# EAGLE design oloduino (EAGLE 5.10)
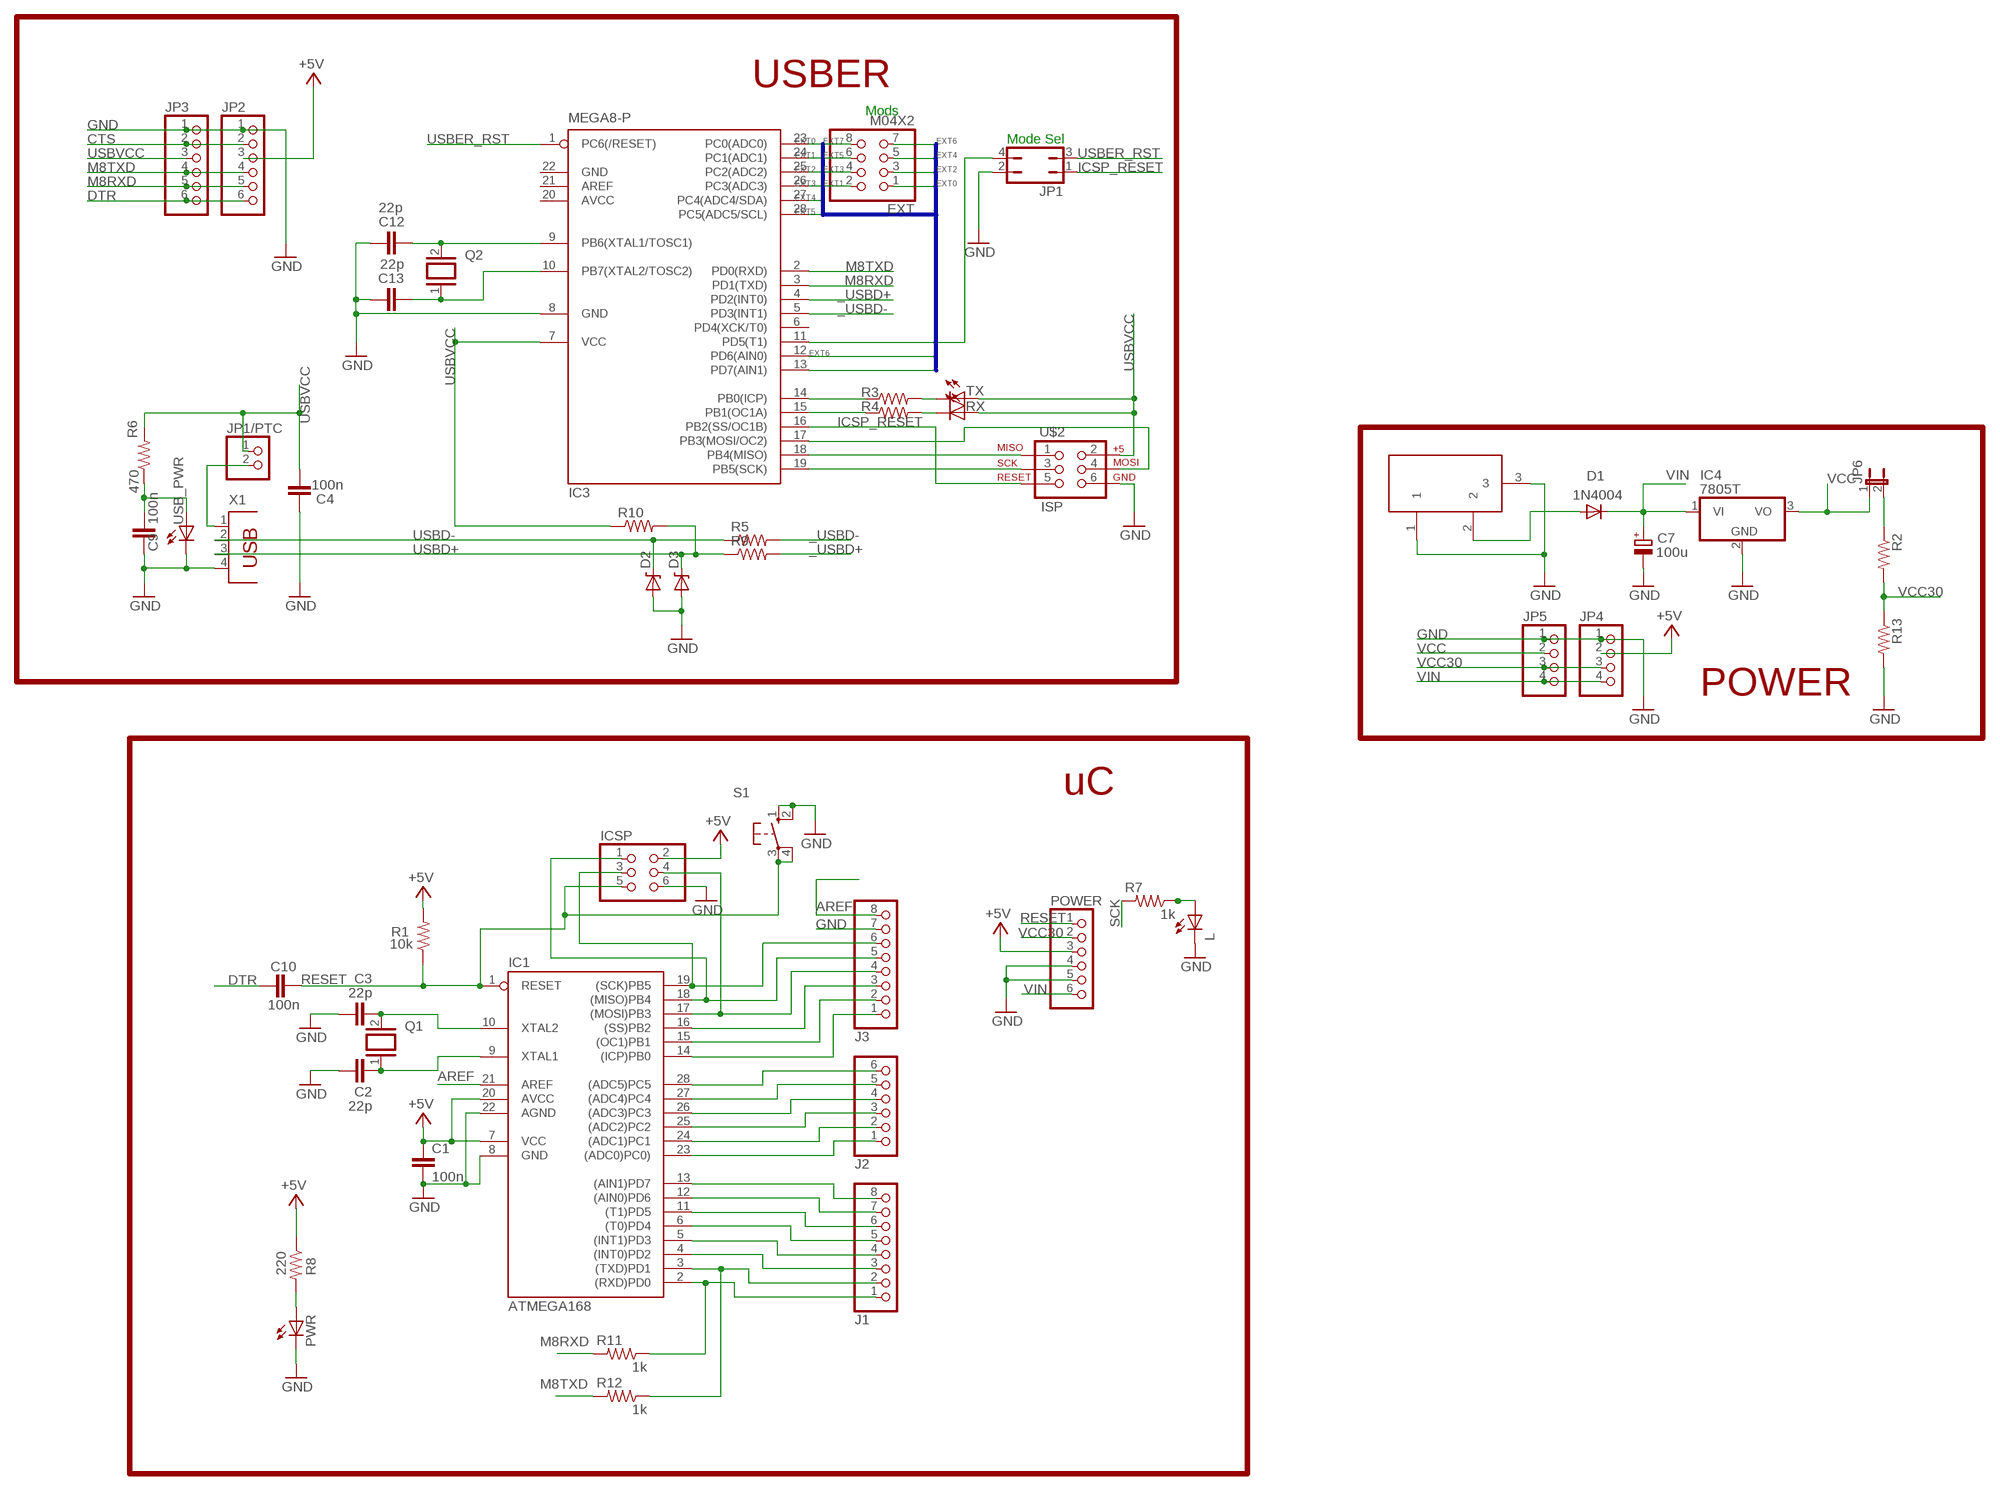
[diagram p0: schematic, sheet 1]

## Parts
C1  100n  C-EU050-025X075  [C050-025X075]
C2  22p  C-EU050-025X075  [C050-025X075]
C3  22p  C-EU050-025X075  [C050-025X075]
C4  100n  C-EU050-025X075  [C050-025X075]
C7  100u  CPOL-EUE3.5-8  [E3,5-8]
C9  100n  C-EU050-025X075  [C050-025X075]
C10  100n  C-EU050-025X075  [C050-025X075]
C12  22p  C-EU050-024X044  [C050-024X044]
C13  22p  C-EU050-024X044  [C050-024X044]
D1  1N4004  [DO41-10]
D2  DIODE-ZENERSMB  [SMB-DIODE]
D3  DIODE-ZENERSMB  [SMB-DIODE]
DC1  DC21MMX  [DC-21MM]
EXT  M04X2  PINHD-2X4  [2X04]
IC1  ATMEGA168  AT90S4433P  [DIL28-3]
IC3  MEGA8-P  [DIL28-3]
IC4  7805T  [TO220H]
ICSP  PINHD-2X3  [2X03]
J1  PINHD-1X8  [1X08]
J2  PINHD-1X6  [1X06]
J3  PINHD-1X8  [1X08]
JP1  JP2Q  [JP2Q]
JP1/PTC  PINHD-1X2  [1X02]
JP2  PINHD-1X6  [1X06]
JP3  PINHD-1X6  [1X06]
JP4  PINHD-1X4  [1X04]
JP5  PINHD-1X4  [1X04]
JP6  JUMPER-2SMD-NC  [SJ_2S]
L  LED3MM  [LED3MM]
POWER  PINHD-1X6  [1X06]
PWR  LED3MM  [LED3MM]
Q1  XTAL/S  [QS]
Q2  XTAL/S  [QS]
R1  10k  R-US_0207/10  [0207/10]
R2  R-US_0204/2V  [0204V]
R3  R-US_0207/10  [0207/10]
R4  R-US_0207/10  [0207/10]
R5  R-US_0207/10  [0207/10]
R6  470  R-US_0207/10  [0207/10]
R7  1k  R-US_0207/10  [0207/10]
R8  220  R-US_0207/10  [0207/10]
R9  R-US_0207/10  [0207/10]
R10  R-US_0207/10  [0207/10]
R11  1k  R-US_0207/10  [0207/10]
R12  1k  R-US_0207/10  [0207/10]
R13  R-US_0204/2V  [0204V]
RX  LED3MM  [LED3MM]
S1  10-XX  [B3F-10XX]
TX  LED3MM  [LED3MM]
U$2  ISP  AVR_SPI_PRG_6NS  [2X3-NS]
USB_PWR  LED3MM  [LED3MM]
X1  PN61729  [PN61729]

## Nets
+5V [power]: C1.1 IC1.7(VCC) IC1.20(AVCC) ICSP.2 JP2.3 JP4.2 POWER.3 R1.2 R8.1
_USBD+: IC3.4(PD2(INT0)) R9.2
_USBD-: IC3.5(PD3(INT1)) R5.2
AREF: IC1.21(AREF) J3.8
CTS: JP2.2 JP3.2
DTR: C10.1 JP2.6 JP3.6
EXT0: EXT.1 IC3.23(PC0(ADC0))
EXT1: EXT.2 IC3.24(PC1(ADC1))
EXT2: EXT.3 IC3.25(PC2(ADC2))
EXT3: EXT.4 IC3.26(PC3(ADC3))
EXT4: EXT.5 IC3.27(PC4(ADC4/SDA))
EXT5: EXT.6 IC3.28(PC5(ADC5/SCL))
EXT6: EXT.7 IC3.12(PD6(AIN0))
EXT7: EXT.8 IC3.13(PD7(AIN1))
GND [power]: C1.2 C2.1 C3.1 C4.2 C7.- C9.2 C12.2 C13.1 D2.A D3.A DC1.1 DC1.3 IC1.8(GND) IC1.22(AGND) IC3.8(GND) IC4.2(GND) ICSP.6 J3.7 JP1.2 JP2.1 JP3.1 JP4.1 JP5.1 L.K(C) POWER.4 POWER.5 PWR.K(C) R13.2 S1.1(S) S1.2(S1) U$2.6 USB_PWR.K(C) X1.4
ICSP_RESET: IC3.16(PB2(SS/OC1B)) JP1.1 U$2.5
M8RXD: IC3.3(PD1(TXD)) JP2.5 JP3.5 R11.2
M8TXD: IC3.2(PD0(RXD)) JP2.4 JP3.4 R12.2
N$1: IC1.18((MISO)PB4) ICSP.1 J3.5
N$2: L.A R7.1
N$3: PWR.A R8.2
N$4: IC1.17((MOSI)PB3) ICSP.4 J3.4
N$5: IC1.14((ICP)PB0) J3.1
N$6: C2.2 IC1.9(XTAL1) Q1.1
N$7: C3.2 IC1.10(XTAL2) Q1.2
N$8 [power]: D1.A DC1.2
N$9: C12.1 IC3.9(PB6(XTAL1/TOSC1)) Q2.2
N$10: IC1.4((INT0)PD2) J1.3
N$11: IC1.5((INT1)PD3) J1.4
N$12: IC1.6((T0)PD4) J1.5
N$13: IC1.11((T1)PD5) J1.6
N$14: IC1.12((AIN0)PD6) J1.7
N$15: IC1.13((AIN1)PD7) J1.8
N$16: IC1.23((ADC0)PC0)) J2.1
N$17: IC1.24((ADC1)PC1) J2.2
N$18: IC1.25((ADC2)PC2) J2.3
N$19: IC1.26((ADC3)PC3) J2.4
N$20: IC1.27((ADC4)PC4) J2.5
N$21: IC1.28((ADC5)PC5) J2.6
N$22: IC1.15((OC1)PB1) J3.2
N$23: IC1.16((SS)PB2) J3.3
N$25: R3.2 TX.K(C)
N$26: IC3.14(PB0(ICP)) R3.1
N$27: R4.2 RX.K(C)
N$28: IC3.15(PB1(OC1A)) R4.1
N$29: JP6.2 R2.1
N$30: C9.1 R6.1 USB_PWR.A
N$34 [power]: JP1/PTC.2 X1.1
N$35: IC3.11(PD5(T1)) JP1.4
N$41: C13.2 IC3.10(PB7(XTAL2/TOSC2)) Q2.1
N$43: IC3.17(PB3(MOSI/OC2)) U$2.4
N$46: IC3.18(PB4(MISO)) U$2.1
N$47: IC3.19(PB5(SCK)) U$2.3
RESET: C10.2 IC1.1(RESET) ICSP.5 POWER.1 R1.1 S1.3(P) S1.4(P1)
RXD: IC1.2((RXD)PD0) J1.1 R11.1
SCK: IC1.19((SCK)PB5) ICSP.3 J3.6 R7.2
TXD: IC1.3((TXD)PD1) J1.2 R12.1
USBD+: D3.C R9.1 R10.2 X1.3
USBD-: D2.C R5.1 X1.2
USBER_RST: IC3.1(PC6(/RESET)) JP1.3
USBVCC [power]: C4.1 IC3.7(VCC) JP1/PTC.1 JP3.3 R6.2 R10.1 RX.A TX.A U$2.2
VCC [power]: IC4.3(VO) JP5.2 JP6.1
VCC30: JP4.3 JP5.3 POWER.2 R2.2 R13.1
VIN [power]: C7.+ D1.C IC4.1(VI) JP4.4 JP5.4 POWER.6
Unconnected: IC3.6(PD4(XCK/T0)) IC3.21(AREF)

## Buses
EXT[0..8]

## Notes on the sheet
- USBER
- Mods
- Mode Sel
- POWER
- uC

## Power pins joined to a net without a drawn wire
AVCC: IC3.20(AVCC)
GND: IC3.22(GND)

## Library data of the parts
C1-C4 C9 C10 C12 C13 = rcl:C-EU: CAPACITOR, European symbol
C7 = rcl:CPOL-EU: POLARIZED CAPACITOR, European symbol
D1 = diode:1N4004: DIODE general purpose rectifier, 1 A
D2 D3 = SparkFun:DIODE-ZENER
DC1 = powersupply:DC21MM
EXT = pinhead:PINHD-2X4: PIN HEADER
IC1 = atmel:AT90S4433: MICROCONTROLLER 4 Kbytes FLASH 128 bytes SRAM 256 bytes EEPROM UART 6-channel 10 bit ADC
IC3 = atmel:MEGA8-P: MICROCONTROLLER 8 Kbytes FLASH, 1 kbytes SRAM, 512 bytes EEPROM, USART, 4-channel 10 bit ADC, 2-channel 8 bit ADC Pin compatible with Atmega48, ATMega88, ATMega168 Source: avr.lbr
IC4 = linear:78*: Positive VOLTAGE REGULATOR Source: http://cache.national.com/ds/LM/LM78L05.pdf http://www.fairchildsemi.com/ds/LM/LM7805.pdf
ICSP = pinhead:PINHD-2X3: PIN HEADER
J1 J3 = pinhead:PINHD-1X8: PIN HEADER
J2 JP2 JP3 POWER = pinhead:PINHD-1X6: PIN HEADER
JP1 = jumper:JP2Q: JUMPER
JP1/PTC = pinhead:PINHD-1X2: PIN HEADER
JP4 JP5 = pinhead:PINHD-1X4: PIN HEADER
JP6 = SparkFun:JUMPER-2: Jumper Basic 0.1" spaced jumper. Use with breakaway headers.
L PWR RX TX USB_PWR = led:LED: LED OSRAM: - CHIPLED LG R971, LG N971, LY N971, LG Q971, LY Q971, LO R971, LY R971 LH N974, LH R974 LS Q976, LO Q976, LY Q976 LO Q996 - Hyper CHIPLED LW Q18S LB Q993, LB Q99A, LB R99A - SideLED LS A670, LO A670, LY A670, LG A670, LP A670 LB A673, LV A673, LT A673, LW A673 LH A674 LY A675 LS A676, LA A676, LO A676, LY A676, LW A676 LS A679, LY A679, LG A679 - Hyper Micro SIDELED® LS Y876, LA Y876, LO Y876, LY Y876 LT Y87S - SmartLED LW L88C, LW L88S LB L89C, LB L89S, LG L890 LS L89K, LO L89K, LY L89K LS L896, LA L896, LO L896, LY L896 - TOPLED LS T670, LO T670, LY T670, LG T670, LP T670 LSG T670, LSP T670, LSY T670, LOP T670, LYG T670 LG T671, LOG T671, LSG T671 LB T673, LV T673, LT T673, LW T673 LH T674 LS T676, LA T676, LO T676, LY T676, LB T676, LH T676, LSB T676, LW T676 LB T67C, LV T67C, LT T67C, LS T67K, LO T67K, LY T67K, LW E67C LS E67B, LA E67B, LO E67B, LY E67B, LB E67C, LV E67C, LT E67C LW T67C LS T679, LY T679, LG T679 LS T770, LO T770, LY T770, LG T770, LP T770 LB T773, LV T773, LT T773, LW T773 LH T774 LS E675, LA E675, LY E675, LS T675 LS T776, LA T776, LO T776, LY T776, LB T776 LHGB T686 LT T68C, LB T68C - Hyper Mini TOPLED® LB M676 - Mini TOPLED Santana® LG M470 LS M47K, LO M47K, LY M47K Source: http://www.osram.convergy.de/
Q1 Q2 = special:XTAL/S: CRYSTAL
R1-R13 = resistor:R-US_: RESISTOR, American symbol
S1 = switch-omron:10-XX: OMRON SWITCH
U$2 = SparkFun:AVR_SPI_PRG_6: AVR ISP 6 Pin This is the reduced ISP connector for AVR programming. Common on Arduino. This footprint will take up less PCB space and can be used with a 10-pin to 6-pin adapter such as SKU: BOB-08508
X1 = con-berg:PN61729: BERG USB connector

## Net classes
1 power: width 0.406 mm

## Board
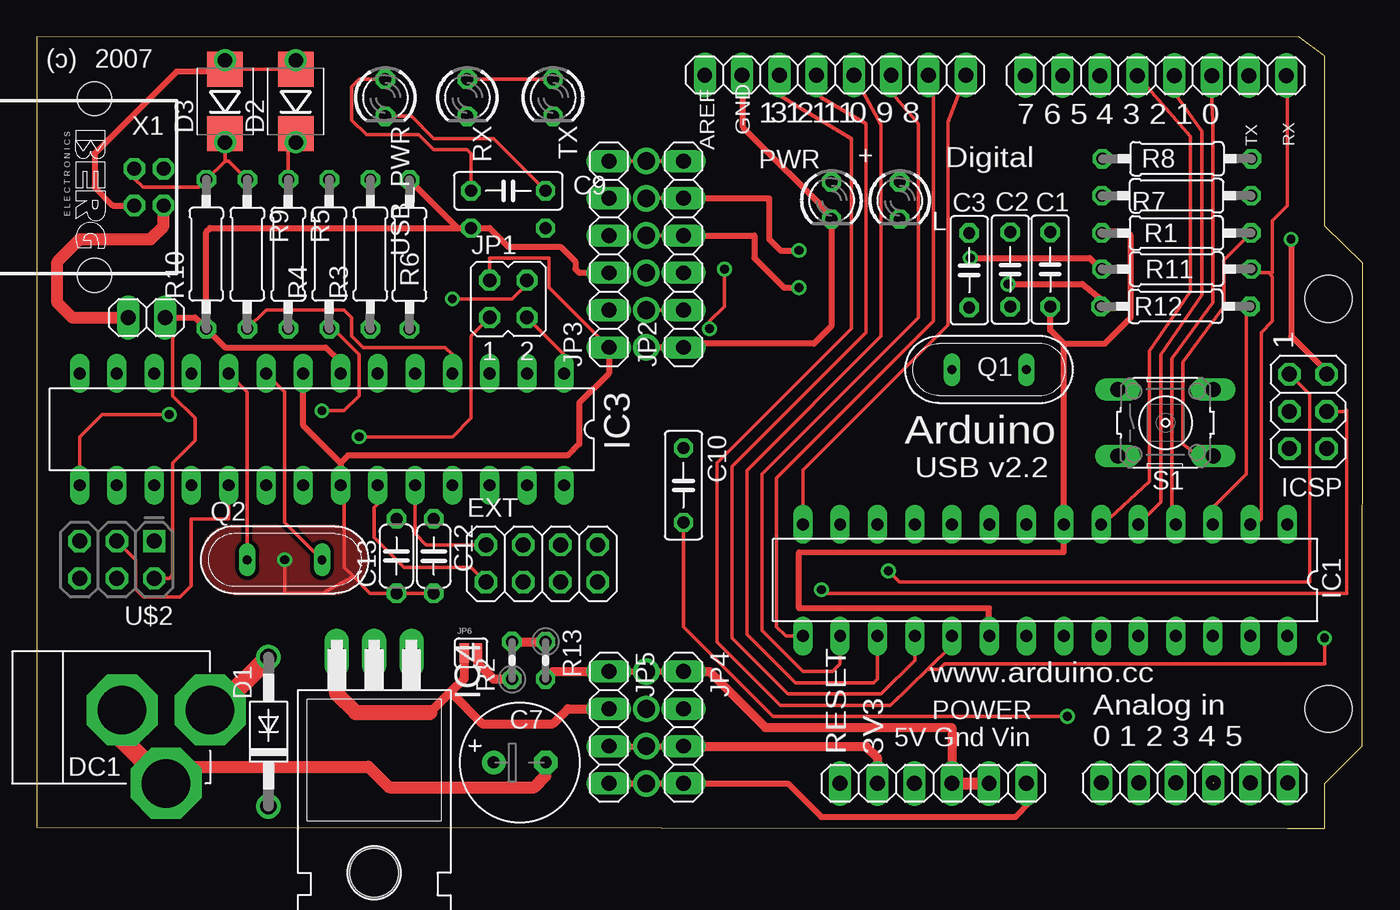
[diagram p1: board, top side]
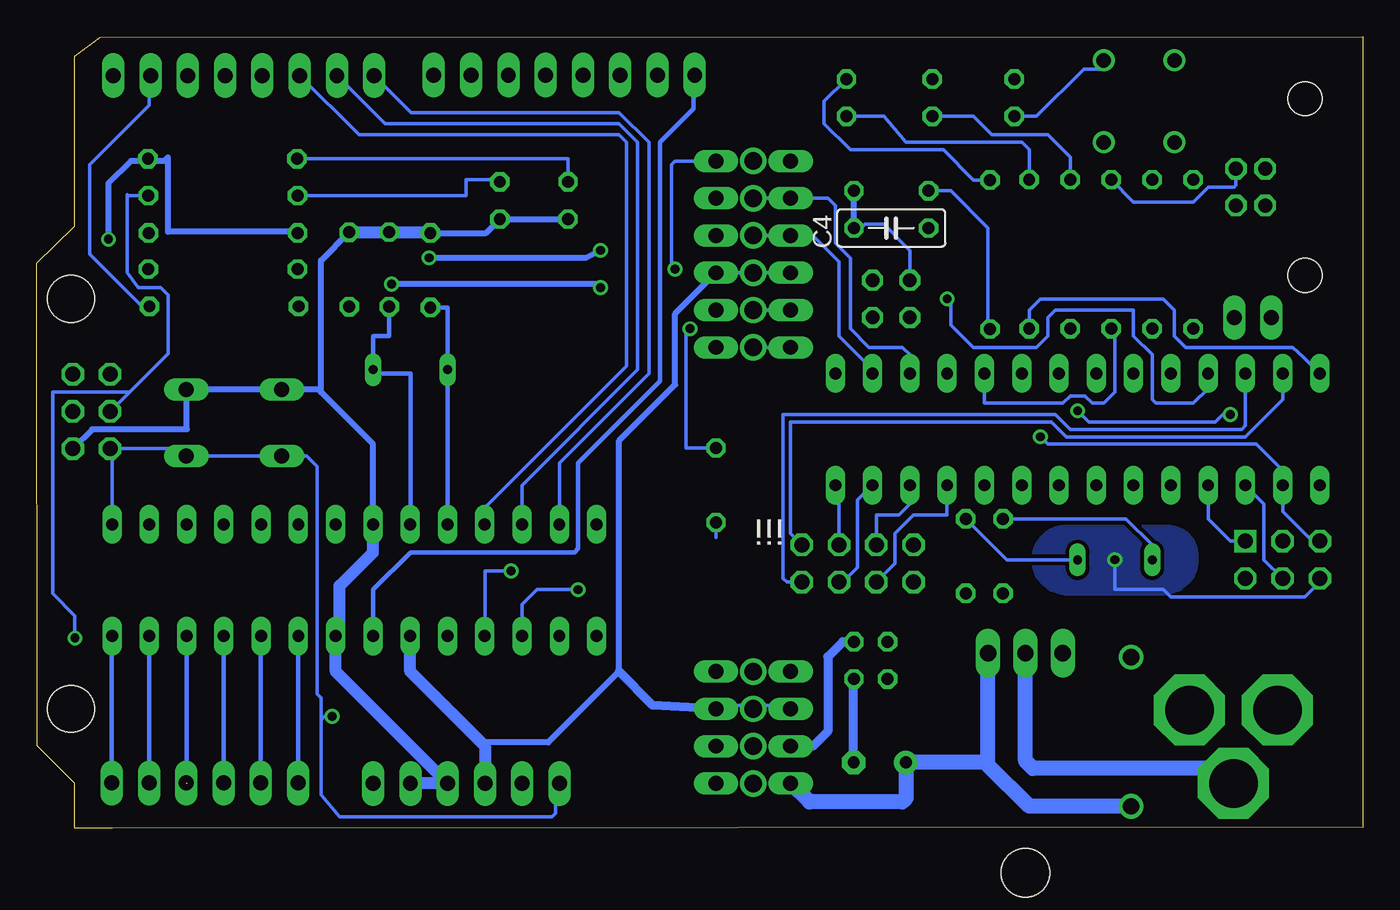
[diagram p2: board, bottom side, seen from below]

Size 90.36 x 53.95 mm. Coordinates in mm from the lower left corner, seen from the top.
Outline: 0,53.95 0,0.05 85.22,0.01 87.78,0 87.77,0.05 87.76,3.06 90.34,5.61 90.36,38.51 87.76,41.05 87.76,52.6 86.03,53.91 0,53.95
Copper layers (1*16): Top 0.035mm / dielectric 1.5mm / Bottom 0.035mm
Design rules "default *": minimum track width 10mil, minimum drill 10mil, track to track 10mil, track to pad 10mil, pad to pad 10mil, via to via 10mil, smd to smd 8mil, copper to edge 20mil, drill to drill 8mil, minimum pad ring 10mil, minimum via ring 8mil, stop-mask expansion 4mil, vias tented up to drill 0mil, thermal gap 10mil
Holes 3.2 mm at 88.01,36.08 88.01,8.14
tKeepout: 3 lines
bKeepout: 2 lines

### Footprints (pad centres in the part's own frame; a part is rotated, then mirrored left to right if it is on the bottom)
C050-025X075 = drill 0.813 octagon: 1 -2.54,0; 2 2.54,0
E3,5-8 = drill 0.813 pad 1.6 round: + -1.778,0 | drill 0.813 pad 1.6 octagon: - 1.778,0
C050-024X044 = drill 0.813 octagon: 1 -2.54,0; 2 2.54,0
DO41-10 = drill 1.118 round: A 5.08,0; C -5.08,0
SMB-DIODE = smd 2.4 x 2.4: A 2.2,0; C -2.2,0
DC-21MM = drill 3.302 pad 4.826 octagon: 1 -5.08,-3.353; 2 -0.076,-6.35; 3 -0.076,-0.356
2X04 = drill 1.016 octagon: 1 -3.81,-1.27; 2 -3.81,1.27; 3 -1.27,-1.27; 4 -1.27,1.27; 5 1.27,-1.27; 6 1.27,1.27; 7 3.81,-1.27; 8 3.81,1.27
DIL28-3 = drill 0.813 long: 1 -16.51,-3.81; 2 -13.97,-3.81; 3 -11.43,-3.81; 4 -8.89,-3.81; 5 -6.35,-3.81; 6 -3.81,-3.81; 7 -1.27,-3.81; 8 1.27,-3.81; 9 3.81,-3.81; 10 6.35,-3.81; 11 8.89,-3.81; 12 11.43,-3.81; 13 13.97,-3.81; 14 16.51,-3.81; 15 16.51,3.81; 16 13.97,3.81; 17 11.43,3.81; 18 8.89,3.81; 19 6.35,3.81; 20 3.81,3.81; 21 1.27,3.81; 22 -1.27,3.81; 23 -3.81,3.81; 24 -6.35,3.81; 25 -8.89,3.81; 26 -11.43,3.81; 27 -13.97,3.81; 28 -16.51,3.81
TO220H = drill 1.118 long: 1 -2.54,-10.16; 2 0,-10.16; 3 2.54,-10.16 | hole 3.302: 0,4.826
2X03 = drill 1.016 octagon: 1 -2.54,-1.27; 2 -2.54,1.27; 3 0,-1.27; 4 0,1.27; 5 2.54,-1.27; 6 2.54,1.27
1X08 = drill 1.016 long: 1 -8.89,0; 2 -6.35,0; 3 -3.81,0; 4 -1.27,0; 5 1.27,0; 6 3.81,0; 7 6.35,0; 8 8.89,0
1X06 = drill 1.016 long: 1 -6.35,0; 2 -3.81,0; 3 -1.27,0; 4 1.27,0; 5 3.81,0; 6 6.35,0
JP2Q = drill 0.914 octagon: 1 -1.27,-1.27; 2 -1.27,1.27; 3 1.27,-1.27; 4 1.27,1.27
1X02 = drill 1.016 long: 1 -1.27,0; 2 1.27,0
1X04 = drill 1.016 long: 1 -3.81,0; 2 -1.27,0; 3 1.27,0; 4 3.81,0
SJ_2S = smd 0.635 x 1.27: 1 -0.45,0; 2 0.45,0
LED3MM = drill 0.813 octagon: A -1.27,0; K 1.27,0
QS = drill 0.61 long: 1 -2.54,0; 2 2.54,0
0207/10 = drill 0.813 octagon: 1 -5.08,0; 2 5.08,0
0204V = drill 0.813 octagon: 1 -1.27,0; 2 1.27,0
B3F-10XX = drill 1.016 long: 1 -3.251,2.261; 2 3.251,2.261; 3 -3.251,-2.261; 4 3.251,-2.261
2X3-NS = drill 1.016 square: 1 -2.54,-1.27 | drill 1.016 octagon: 2 -2.54,1.27; 3 0,-1.27; 4 0,1.27; 5 2.54,-1.27; 6 2.54,1.27
PN61729 = drill 0.95 octagon: 1 1.25,4.71; 2 -1.25,4.71; 3 -1.25,2.71; 4 1.25,2.71 | hole 2.3: -6.02,0; 6.02,0

### Placement (x,y rotation side)
C1  69.06,38.08 90 top
C2  66.34,38.09 270 top
C3  63.54,38.04 270 top
C4  32.13,40.9 180 bottom
C7  32.91,4.48 0 top
C9  32.13,43.44 0 top
C10  44.07,23.38 270 top
C12  27.05,18.55 270 top
C13  24.51,18.55 90 top
D1  15.8,6.58 90 top
D2  17.66,49.54 90 top
D3  12.83,49.54 90 top
DC1  5.46,8.14 90 top
EXT  34.42,18.04 0 top
IC1  68.72,16.91 180 top
IC3  19.43,27.19 180 top
IC4  22.99,1.79 180 top
ICSP  86.63,28.41 270 top
J1  76.26,51.3 180 top
J2  78.9,3.09 0 top
J3  54.41,51.34 180 top
JP1  32.13,36.08 0 top
JP1/PTC  7.5,34.81 180 top
JP2  44.07,39.13 90 top
JP3  38.99,39.13 90 top
JP4  44.07,6.87 270 top
JP5  38.99,6.87 270 top
JP6  29.59,11.95 0 top
L  58.8,42.78 270 top
POWER  61.09,3.06 0 top
PWR  54.16,42.78 270 top
Q1  64.9,31.26 180 top
Q2  16.89,18.3 0 top
R1  77.66,40.57 180 top
R2  32.39,11.44 90 top
R3  22.74,39.13 90 top
R4  19.94,39.13 90 top
R5  17.15,39.13 270 top
R6  25.4,39.1 90 top
R7  77.68,43.11 0 top
R8  77.7,45.63 180 top
R9  14.35,39.13 270 top
R10  11.56,39.13 90 top
R11  77.68,38.11 180 top
R12  77.6,35.57 180 top
R13  34.67,11.44 270 top
RX  29.34,49.79 270 top
S1  76.91,27.63 0 top
TX  35.18,49.79 270 top
U$2  5.46,18.3 180 top
USB_PWR  23.75,49.79 270 top
X1  3.94,43.7 270 top

### Tracks (layer width: path | path; a pad name or v marks a point on that pad's centre or on a via)
+5V  (via drill 0.6)
  Top 0.406: IC1.20 64.9,15 51.95,15 51.95,18.81 69.99,18.82 IC1.7 69.98,33.03 | 69.98,33.03 69.06,33.95 C1.1 | R1.2 72.58,40.46 72.77,40.65 74.3,40.65 74.55,40.4 74.55,34.81 72.77,33.03 69.98,33.03 | v85.47,40.14 85.47,33.54 87.9,31.11 ICSP.2
  Bottom 0.254: 38.99,8.39 43.82,8.39 JP4.2
  Bottom 0.406: 82.93,45.48 R8.1 | 82.93,45.48 83.95,45.48 85.47,43.95 v85.47,40.14 | R1.2 72.66,40.65 81.41,40.65 81.41,45.73 81.66,45.48 82.93,45.48 | JP2.3 46.87,35.06 46.87,30.24 50.68,26.43 50.68,10.68 55.5,5.85 60.07,5.85
  Bottom 0.61: JP4.2 48.39,8.39 50.68,10.68
  Bottom 0.813: POWER.3 59.82,5.6 60.07,5.85 64.91,10.69 IC1.20
_USBD+
  Top 0.254: IC3.4 28.32,32.27 27.82,32.78 22.23,32.78 21.47,33.54 21.47,34.81 20.96,35.32 15.62,35.32 R9.2
_USBD-
  Bottom 0.254: IC3.5 25.78,28.97 20.45,28.97 19.94,29.47 18.93,29.47 18.42,28.97 17.66,28.97 16.89,29.73 16.89,33.79 R5.2
AREF
  Bottom 0.305: IC1.21 67.44,16.27 64.9,18.81 53.72,18.81 53.47,19.06 53.47,24.9 47.88,30.49 47.88,46.75 45.6,49.03 45.6,51.27 J3.8
CTS  (via drill 1.2)
  Top 0.254: v41.53,35.32 JP2.2
  Bottom 0.254: JP3.2 v41.53,35.32
DTR  (via drill 0.6, 1.2)
  Top 0.254: v45.85,34.05 45.85,34.55 46.87,35.57 v46.87,38.11 | JP2.6 v41.53,45.48 JP3.6
  Bottom 0.254: v45.85,34.05 46.1,33.79 46.1,25.92 C10.1 | v46.87,38.11 47.12,38.62 47.12,45.22 46.87,45.48 JP2.6
EXT0
  Top 0.254: IC3.23 23.24,22.11 22.99,21.85 22.99,19.82 25.02,17.79 29.59,17.79 EXT.1
EXT1
  Top 0.254: EXT.2 26.55,19.31 25.78,20.08 IC3.24
EXT2
  Bottom 0.254: EXT.3 31.88,18.04 31.88,20.08 30.61,21.35 28.32,21.35 IC3.25
EXT3
  Bottom 0.254: EXT.4 33.15,21.35 31.63,21.35 30.86,22.11 IC3.26
EXT4
  Bottom 0.254: EXT.5 35.44,16.77 34.42,17.79 34.42,22.36 IC3.27
EXT5
  Bottom 0.254: EXT.6 35.69,23.12 IC3.28
EXT6
  Bottom 0.254: IC3.12 8,27.44 8.26,27.19 19.94,27.19 20.96,28.2 39.5,28.2 39.5,17.03 39.25,16.77 EXT.7
EXT7
  Bottom 0.254: IC3.13 5.46,29.22 8,26.68 20.2,26.68 21.21,27.7 38.99,27.7 38.99,20.08 EXT.8
GND  (via drill 0.6, 1, 1.2)
  Top 0.254: C12.2 C13.1 22.74,16.01 21.59,17.16 | 21.59,17.16 20.96,17.79 20.96,23.12 IC3.22 | v16.89,18.3 16.89,16.01 19.43,16.01 21.59,17.16 | USB_PWR.K 25.53,48.52 27.05,47 31.12,47 C9.2 | D3.A D2.A v17.66,52.33 | JP3.1 34.93,36.84 34.93,38.87 30.86,38.87 JP1.2
  Top 0.406: J3.7 48.14,51.27 48.14,47.76 54.16,41.74 PWR.K 54.16,34.22 52.96,33.03 44.33,33.03 JP2.1 v41.53,32.78 | JP5.1 v41.53,10.68 JP4.1 | 20.7,24.9 IC3.22 | 20.7,24.9 18.16,27.44 IC3.8 | X1.4 5.19,42.45 3.94,43.7 3.94,45.98 9.53,51.57 12.66,51.57 D3.A 12.83,51.57 | JP3.1 38.99,31 36.96,28.97 36.96,26.17 36.2,25.41 21.21,25.41 20.7,24.9
  Top 0.61: JP4.1 45.85,10.68 49.66,6.87 62.36,6.87 POWER.4 | R13.2 35.18,10.68 JP5.1 | 34.67,3.57 34.67,4.46 C7.-
  Top 0.813: POWER.4 POWER.5 | 34.67,3.57 33.91,2.8 24.01,2.8 22.61,4.2 9.96,4.2 DC1.1
  Top 1.27: DC1.3 5.82,6.06 DC1.1
  Bottom 0.254: U$2.6 2.92,16.77 3.94,15.76 13.08,15.76 13.59,16.27 16.89,16.27 v16.89,18.3 | JP1.2 30.86,39.38 32.64,41.16 33.91,41.16 34.17,40.9 C4.2 | USB_PWR.K 22.23,48.52 19.01,51.74 17.74,51.74 17.66,51.83 v17.66,52.33 | v41.53,32.78 JP3.1
  Bottom 0.406: PWR.K L.K 59.74,40.57 C3.1 63.59,40.62 | C1.2 71,38.69 71,29.73 | 71,29.73 71.16,29.89 S1.1 S1.2 80.17,27.21 80.14,27.19 86.58,27.19 ICSP.6 | 71,29.73 67.45,26.18 IC1.8 | IC1.22 69.73,13.36 | C4.2 C9.2
  Bottom 0.61: C7.- 34.69,10.15 R13.2
  Bottom 0.813: C1.2 63.59,40.62 | C1.2 C2.1 | POWER.5 POWER.4 69.99,10.69 IC1.22 | 69.73,13.36 69.73,16.52 67.45,18.8 IC1.8
  Bottom 1.016: IC4.2 22.99,4.58 22.48,4.07 9.83,4.07 DC1.1
  pour Bottom: 11.31,18.3 11.31,18.55 arc-90 13.34,20.58 20.2,20.58 arc-90 22.48,18.3 arc-90 20.2,16.01 13.59,16.01 arc-90
  pour Top: 11.31,18.3 11.31,18.55 arc-90 13.34,20.58 20.2,20.58 arc-90 22.48,18.3 arc-90 20.2,16.01 13.59,16.01 arc-90
ICSP_RESET  (via drill 0.6)
  Top 0.254: v21.97,26.68 28.32,26.68 29.59,27.95 29.59,33.54 JP1.1
  Bottom 0.254: U$2.5 3.43,19.57 5.46,21.6 IC3.16 5.46,24.39 7.24,26.17 21.47,26.17 v21.97,26.68
M8RXD  (via drill 0.6, 1.2)
  Top 0.254: v41.53,42.94 JP2.5
  Top 0.406: v51.95,39.38 50.68,39.38 49.91,40.14 49.91,42.94 JP2.5 | v63.63,38.87 71.76,38.87 72.52,38.11 R11.2
  Bottom 0.254: IC3.3 30.86,32.27 31.37,32.78 33.66,32.78 34.93,34.05 34.93,38.87 35.94,39.89 35.94,42.43 36.45,42.94 JP3.5 v41.53,42.94
  Bottom 0.406: v51.95,39.38 52.96,38.87 v63.63,38.87
M8TXD  (via drill 0.6, 1.2)
  Top 0.254: v41.53,40.4 JP2.4
  Top 0.406: JP2.4 48.9,40.4 48.9,38.87 50.93,36.84 v51.95,36.84 | v66.17,37.09 71.25,37.09 72.52,36.08 R12.2
  Bottom 0.254: IC3.2 33.66,31.25 33.66,31.51 35.69,33.54 35.69,38.62 37.47,40.4 JP3.4 v41.53,40.4
  Bottom 0.406: v51.95,36.84 52.2,37.09 v66.17,37.09
N$1  (via drill 0.6)
  Top 0.254: J3.5 53.22,51.27 53.22,50.05 53.47,49.79 56.52,48.02 56.52,33.79 47.37,24.65 47.37,12.96 51.18,9.15 57.53,9.15 59.83,11.45 IC1.18 | ICSP.1 86.74,29.56 86.74,16.77 58.8,16.77 v58.04,17.54
  Bottom 0.254: IC1.18 59.82,17.54 v58.04,17.54
N$2
  Bottom 0.254: R7.1 61.09,43.11 61.09,44.21 58.8,44.21 L.A
N$3
  Bottom 0.254: R8.2 54.16,45.63 PWR.A
N$4  (via drill 0.6)
  Top 0.254: J3.4 57.53,47.96 57.53,33.54 48.39,24.39 48.39,13.22 51.69,9.92 57.03,9.92 57.29,10.18 IC1.17 | v53.47,16.27 53.72,16.01 89.28,16.01 89.28,28.46 89.23,28.41 ICSP.4
  Bottom 0.254: IC1.17 57.28,15.25 56.26,16.27 v53.47,16.27
N$5
  Top 0.254: J3.1 62.11,48.11 62.11,34.3 52.21,24.41 IC1.14
N$6
  Bottom 0.305: C2.2 66.34,33.54 67.44,33.54 Q1.1 67.44,31 64.9,31 IC1.9
N$7
  Bottom 0.305: C3.2 62.36,35.49 Q1.2 IC1.10
N$8
  Top 1.27: DC1.2 12.2,8.06 D1.A
N$9
  Top 0.254: IC3.9 16.89,29.73 16.89,20.84 Q2.2
  Bottom 0.254: Q2.2 24.26,18.3 C12.1
N$10
  Top 0.254: IC1.4 77.35,21.24 77.35,32.01 80.14,35.82 80.14,48.27 80.07,49.36 J1.3
N$11
  Top 0.254: IC1.5 76.58,22.23 76.58,32.27 79.38,36.33 79.38,47.51 77.53,50.12 J1.4
N$12
  Top 0.254: J1.5 78.62,47.16 78.62,36.59 75.82,32.52 75.82,23.63 72.65,20.72 IC1.6
N$13
  Bottom 0.254: J1.6 68.41,47.25 50.68,47.25 50.17,46.75 50.17,31.51 59.83,21.84 IC1.11
N$14
  Bottom 0.254: J1.7 66.63,48.02 50.68,48.02 49.41,46.75 49.41,31.25 57.29,23.37 IC1.12
N$15
  Bottom 0.254: J1.8 64.85,48.78 50.68,48.78 48.64,46.75 48.64,31 54.75,24.89 IC1.13
N$16
  Bottom 0.305: J2.1 72.53,3.09 IC1.23
N$17
  Bottom 0.305: IC1.24 75.09,13.1 J2.2
N$18
  Bottom 0.305: J2.3 77.61,3.09 IC1.25
N$19  (1 unrouted)
  Bottom 0.305: IC1.26 80.14,3.06
N$20
  Bottom 0.305: J2.5 82.69,3.09 IC1.27
N$21
  Bottom 0.305: IC1.28 85.25,13.1 J2.6
N$22
  Top 0.254: J3.2 61.09,51.27 61.09,34.55 50.42,23.89 50.42,13.73 51.05,13.1 IC1.15
N$23
  Top 0.254: J3.3 58.3,51.27 58.3,50.05 60.07,48.02 60.07,34.81 49.41,24.14 49.41,13.47 52.2,10.68 54.23,10.68 54.75,11.2 IC1.16
N$25
  Bottom 0.254: TX.K 32.64,48.52 31.12,46.75 23.24,46.75 22.74,46.24 R3.2
N$26
  Bottom 0.254: IC3.14 4.05,32.12 4.76,32.78 12.07,32.78 12.83,33.54 12.83,35.32 13.59,36.08 21.97,36.08 22.74,35.32 R3.1
N$27
  Bottom 0.254: RX.K 26.55,48.52 25.28,47.25 21.47,47.25 19.94,45.73 R4.2
N$28  (via drill 0.6)
  Top 0.254: v9.02,28.2 4.45,28.2 2.92,26.68 IC3.15 | v19.43,28.46 20.96,28.46 21.97,29.47 21.97,32.27 20.2,34.05 R4.1
  Bottom 0.254: v9.02,28.2 9.53,28.2 10.04,27.7 18.67,27.7 v19.43,28.46
N$29
  Top 0.61: JP6.2 30.04,11.24 31.12,10.17 R2.1
N$30
  Top 0.254: C9.1 29.59,45.98 29.34,46.24 27.05,46.24 26.04,47.25 22.48,47.25 21.47,48.27 21.47,50.56 21.97,51.06 USB_PWR.A
  Bottom 0.254: C9.1 28.07,43.44 25.53,40.9 25.53,34.15 R6.1
N$31  (via drill 1.2)
  other vias: 41.53,37.86
N$32  (via drill 1.2)
  other vias: 41.53,8.14
N$33  (via drill 1)
  other vias: 17.66,46.75
N$34
  Top 0.813: X1.1 8.65,41.04 7.75,40.14 2.92,40.14 1.4,38.62 1.4,35.82 2.42,34.81 JP1/PTC.2
N$35  (via drill 0.6)
  Top 0.254: JP1.4 33.4,37.09 32.39,36.08 v28.32,36.08
  Bottom 0.254: IC3.11 10.54,29.98 11.56,28.97 14.1,28.97 14.35,29.22 14.35,32.27 15.62,33.54 15.62,35.32 20.96,35.32 21.47,34.81 21.47,33.54 22.23,32.78 26.55,32.78 28.07,34.3 28.07,35.82 v28.32,36.08
N$36  (via drill 1)
  other vias: 12.83,46.75
N$37  (via drill 1)
  other vias: 12.83,52.33
N$41
  Top 0.254: IC3.10 14.35,29.73 Q2.1
  Bottom 0.254: Q2.1 14.35,19.31 16.13,21.09 C13.2
N$43
  Bottom 0.254: U$2.4 6.73,18.3 6.73,22.11 IC3.17
N$46
  Bottom 0.254: U$2.1 9.02,19.57 10.54,21.09 IC3.18
N$47
  Top 0.254: U$2.3 6.73,18.3 6.73,16.27 7.24,15.76 9.78,15.76 10.54,16.52 10.54,21.09 13.08,21.09 IC3.19
RESET  (via drill 0.6)
  Top 0.254: R1.1 80.9,38.73 80.9,35.57 78.11,31.76 78.11,26.17 79.16,25.37 S1.4 | C10.2 44.07,13.73 50.17,7.63 v70.23,7.63
  Bottom 0.254: 85.22,25.87 85.22,20.84 | ICSP.5 80.17,25.87 S1.4 S1.3 71.97,25.37 71.25,24.65 71.25,9.15 71,8.9 71,7.38 | POWER.1 54.99,2.8 54.99,1.03 55.25,0.77 69.73,0.77 71,2.3 71,7.38 | v70.23,7.63 70.74,7.63 71,7.38 | C10.2 44.07,19.82
  Bottom 0.305: ICSP.5 85.22,25.87 | 85.22,20.84 85.23,20.84 IC1.1
RXD
  Top 0.254: J1.1 85.22,51.3 85.22,42.43 84.2,41.41 84.2,37.86 83.95,37.86 | IC1.2 83.07,20.72 83.44,21.09 83.44,33.79 84.2,34.55 84.2,37.6 83.95,37.86 | 83.95,37.86 83.01,37.86 R11.1
SCK  (via drill 0.6)
  Top 0.254: 60.68,10.82 58.17,8.39 50.68,8.39 46.36,12.71 46.36,24.9 55.5,34.05 55.5,47 51.69,49.29 50.35,50.12 J3.6 | 60.68,10.82 62.36,12.46 62.37,12.47 IC1.19 | v87.76,12.96 87.76,11.19 61.85,11.19 61.49,10.82 60.68,10.82
  Bottom 0.254: 84.04,29.73 ICSP.3 | R7.2 84.13,43.11 84.2,43.19 84.2,37.86 83.44,36.84 81.92,36.84 81.41,36.33 81.41,32.36 84.04,29.73 | 84.04,29.73 89.28,29.73 89.28,16.01 87.76,14.49 v87.76,12.96
TXD
  Top 0.254: R12.1 82.43,35.32 82.43,24.14 80.15,21.87 IC1.3
  Bottom 0.254: J1.2 82.68,51.3 82.68,49.29 86.74,45.22 86.74,39.13 83.19,35.57 R12.1
USBD+
  Top 0.254: X1.3 6.65,44.29 7.24,43.7 11.05,43.7 R10.2 12.83,45.48 | 12.83,45.48 D3.C | 12.83,45.48 13.08,45.48 R9.1
USBD-
  Top 0.254: R5.1 17.15,46.83 D2.C
  Bottom 0.254: X1.2 8.65,43.81 8.77,43.7 10.54,43.7 11.56,42.68 15.62,42.68 R5.1
USBER_RST
  Top 0.254: IC3.1 35.94,32.27 JP1.3
USBVCC
  Top 0.254: TX.A RX.A | U$2.2 9.02,17.03 9.27,17.28 9.27,24.9 10.8,26.43 10.8,27.95 9.27,29.47 9.27,34.3 JP1/PTC.1
  Top 0.406: IC3.7 20.7,31.76 19.69,32.78 12.83,32.78 R10.1 | JP3.3 36.96,37.86 36.71,38.11 36.71,38.62 35.69,39.63 32.13,39.63 30.86,40.9 C4.1 28.68,40.9 | 28.68,40.9 R6.2 | JP1/PTC.1 10.8,34.81 R10.1 | 28.68,40.9 11.81,40.9 11.56,40.65 R10.1
  Bottom 0.254: R6.2 26.52,44.18 28.58,46.24 34.93,46.24 36.71,48.02 36.71,49.54 TX.A | JP3.3 43.82,37.86
VCC
  Top 0.61: JP6.1 29.14,10.23 28.2,9.28 | 26.8,7.88 28.2,9.28 | JP5.2 36.2,8.14 35.18,7.12 30.36,7.12 28.2,9.28
  Top 1.016: 26.8,7.88 21.72,7.88 20.45,9.15 IC4.3
VCC30  (via drill 1.2)
  Top 0.406: JP5.3 v41.53,5.6 JP4.3
  Top 0.61: JP4.3 56.52,5.6 57.28,4.84 POWER.2 | R2.2 R13.1
  Bottom 0.61: R13.1 35.44,12.71 36.45,11.69 36.45,6.61 37.47,5.6 JP5.3
VIN  (via drill 1.2)
  Top 0.406: JP5.4 v41.53,3.06 JP4.4 51.18,3.06 53.47,0.77 66.68,0.77 67.69,1.79 67.69,2.8 POWER.6
  Bottom 1.016: 25.53,4.29 IC4.1 | 25.53,4.29 22.74,1.5 D1.C | 25.53,4.29 25.72,4.48 C7.+ 31.12,4.46 31.12,2.04 31.37,1.79 37.72,1.79 JP5.4

### Text on the board
bPlace: !!!
tNames: (c) | 2007 | 1 1 1 1 | 3 2 1 0 9 8 | GND | 7 6 5 4 3 2 1 0 | AREF | TX | RX | + | Digital | 1 | Arduino | USB v2.2 | www.arduino.cc | Analog in | RESET | 3V3 | 5V Gnd Vin | 0 1 2 3 4 5